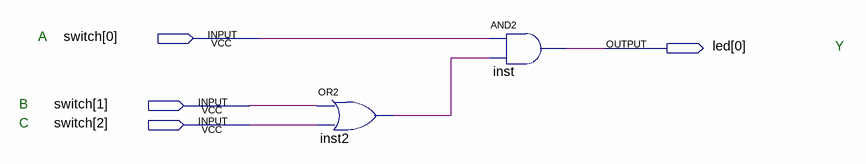
[diagram p0: schematic sheet]
// Quartus schematic pj304.bdf as structural Verilog: 2 symbols, 4 pins
module pj304 (
  input  [2:0] switch,
  output [0:0] led
);

  wire inst2_out;

  or inst2 (inst2_out, switch[1], switch[2]);
  and inst (led[0], switch[0], inst2_out);

  // Notes on the sheet:
  //   A
  //   Y
  //   B
  //   C
endmodule
